# Altium schematic sheet TOP.SchDoc: =DocumentName
size A4; Organization: Queen's Formula SAE; Address1: 130 Stuart St, Kingston; Address2: Ontario; Address3: Canada; Address4: K7L 2V9; DocumentNumber: 1; Revision: 0; SheetNumber: 1; SheetTotal: 1
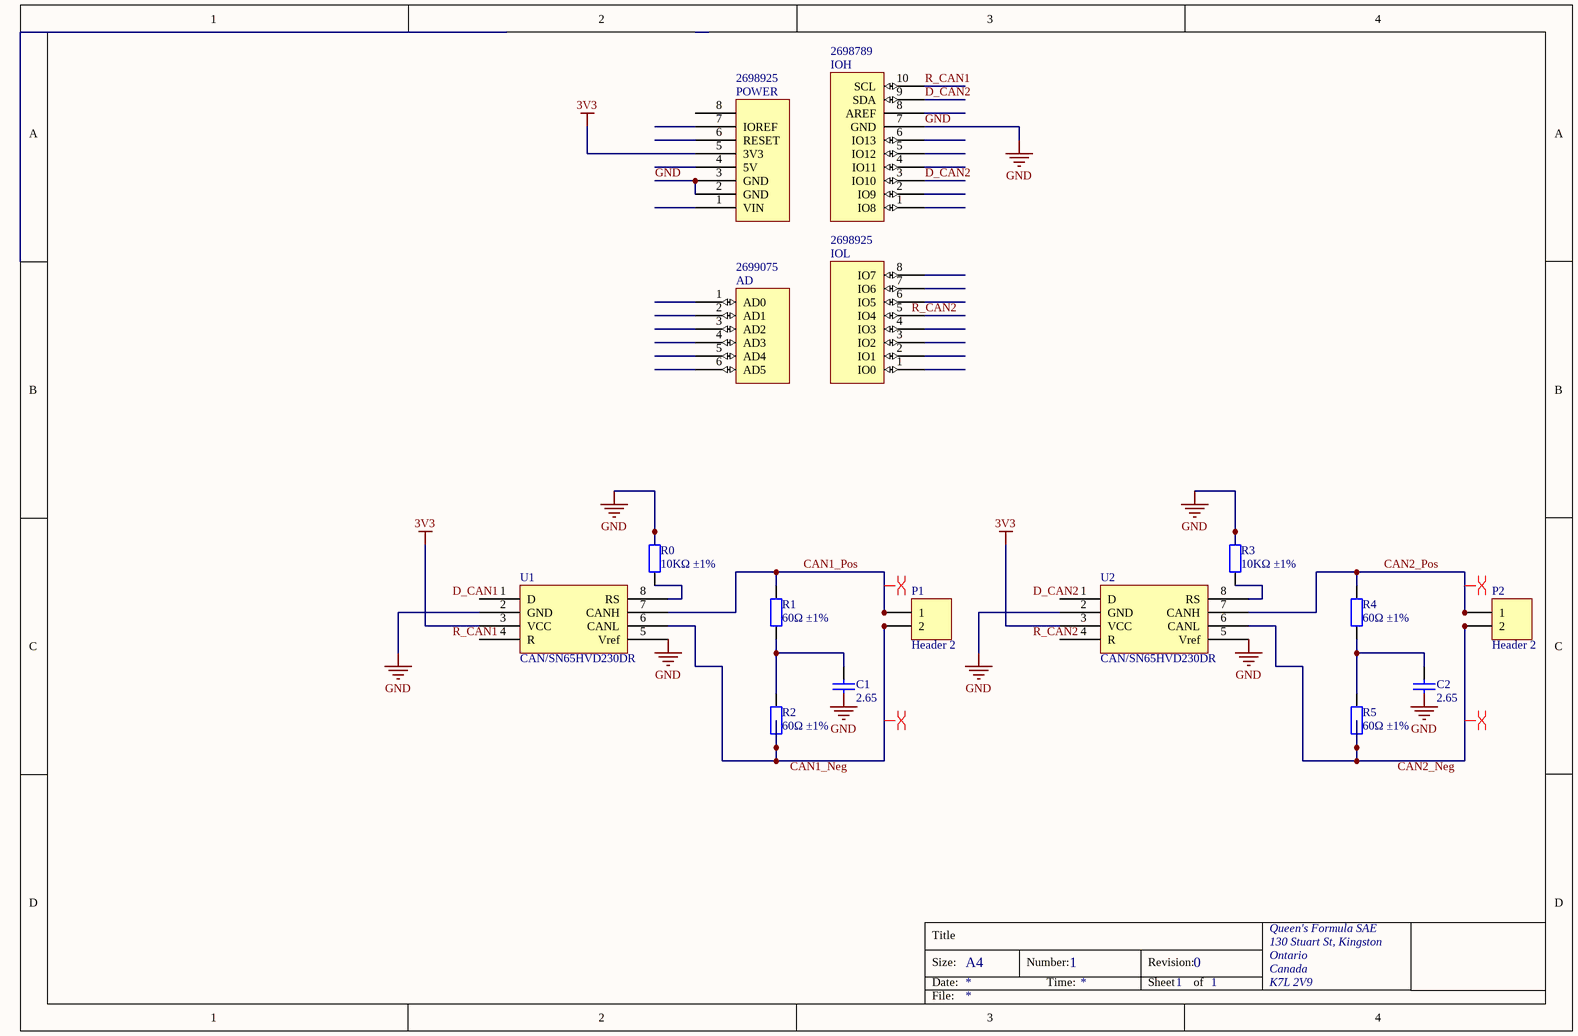
[diagram p0: TOP.SchDoc]

## Parts
AD  Supplier Part Number 4: 2699075  [Header 6x1 8.5mm]  (hidden comment: AD)
C1  2.65  [0402_C]
C2  2.65  [0402_C]
IOH  Supplier Part Number 3: 2698789  [Header 10x1 8.5mm]  (hidden comment: IOH)
IOL  Supplier Part Number 4: 2698925  [Header 8x1 8.5mm]  (hidden comment: IOL)
P1  Header 2  [HDR1X2]
P2  Header 2  [HDR1X2]
POWER  Supplier Part Number 4: 2698925  [Header 8x1 8.5mm]  (hidden comment: POWER_UNO)
R0  10KΩ ±1%  [0402_R]
R1  60Ω ±1%  [0402_R]
R2  60Ω ±1%  [0402_R]
R3  10KΩ ±1%  [0402_R]
R4  60Ω ±1%  [0402_R]
R5  60Ω ±1%  [0402_R]
U1  CAN/SN65HVD230DR  [SOIC-8_150mil]
U2  CAN/SN65HVD230DR  [SOIC-8_150mil]

## Nets
3V3: POWER.5(3V3) U1.3(VCC) U2.3(VCC)
GND: IOH.7(GND) POWER.2(GND) POWER.3(GND) R0.2 R3.2 U1.2(GND) U1.5(Vref) U2.2(GND) U2.5(Vref)
CAN1_Pos: P1.1 R1.2 U1.7(CANH)
CAN2_Pos: P2.1 R4.2 U2.7(CANH)
D_CAN2: IOH.3(IO10) IOH.9(SDA)
R_CAN1: IOH.10(SCL)
NetC1_1: C1.1 R1.1 R2.2
NetC2_1: C2.1 R4.1 R5.2
NetP1_2: P1.2 R2.1 U1.6(CANL)
NetP2_2: P2.2 R5.1 U2.6(CANL)
NetR0_1: R0.1 U1.8(RS)
NetR3_1: R3.1 U2.8(RS)

Not connected (* = marked no-connect by the designer): AD 1(AD0) 2(AD1) 3(AD2) 4(AD3) 5(AD4) 6(AD5); C1 2; C2 2; IOH 1(IO8) 2(IO9) 4(IO11) 5(IO12) 6(IO13) 8(AREF); IOL 1(IO0) 2(IO1) 3(IO2) 4(IO3) 5(IO4) 6(IO5) 7(IO6) 8(IO7); POWER 1(VIN) 4(5V) 6(RESET) 7(IOREF) 8; U1 1(D) 4(R); U2 1(D) 4(R)

## Layout directives
differential pair: CAN1_Pos, CAN2_Pos, NetP1_2, NetP2_2

## Notes on the sheet
- Labels drawn without touching a wire or pin: CAN1_Neg, CAN2_Neg, D_CAN1, D_CAN2, GND, R_CAN1, R_CAN2
- Title
- Size:
- Date:
- A4
- Number:
- Time:
- Revision:
- Sheet
- of
- File:

## Library data of the parts
C1 C2 = 0402 1nF (102) 10% 50V: Chip capacitor; Manufacturer: Guangdong Fenghua Advanced Tech; PartNumber: 0402B102K500NT; Capacitance: 1nF; Tolerance: 10%; Voltage: 50V; ComponentLink1Description: Supplier link; ComponentLink1URL: http://www.szlcsc.com/product/details_1875.html; Package: 0402; Supplier: LC; SuppliersPartNumber: C1523
P1 P2 = Header 2: Header, 2-Pin; LatestRevisionDate: 17-Jul-2002; LatestRevisionNote: Re-released for DXP Platform.; Publisher: Altium Limited
R0 R3 = 0402 10K (1002) 1%: Chip resistor; Manufacturer: Uniroyal Elec; PartNumber: 0402WGF1002TCE; Power: 1/16W; ComponentLink1Description: Supplier link; ComponentLink1URL: http://www.szlcsc.com/product/details_26487.html; Package: 0402; Supplier: LC; SuppliersPartNumber: C25744; Resistance: 10KΩ; Tolerance: 1%
R1 R2 R4 R5 = 0402 10K (1002) 1%: Chip resistor; Manufacturer: Uniroyal Elec; PartNumber: 0402WGF1002TCE; Power: 1/16W; Resistance: 10KΩ; ComponentLink1Description: Supplier link; ComponentLink1URL: http://www.szlcsc.com/product/details_26487.html; Package: 0402; Supplier: LC; SuppliersPartNumber: C25744; Tolerance: 1%
U1 U2 = CAN/SN65HVD230DR_[C12084]: CAN; ComponentLink1Description: 供应商链接; ComponentLink1URL: http://www.szlcsc.com/product/details_12661.html; Package: SOIC-8_150mil; Supplier: LC; SuppliersPartNumber: C12084
AD = AD: Supplier 1: Arrow; Supplier Part Number 1: 2699089; Supplier 2: Digi-Key; Supplier Part Number 2: SAM1198-06-ND; Supplier 3: Arrow; Supplier Part Number 3: 2699088; Supplier 4: Arrow
IOH = IOH: Supplier 1: Arrow; Supplier Part Number 1: 2698803S4475693N1004; Supplier 2: Digi-Key; Supplier Part Number 2: SAM1198-10-ND; Supplier 3: Arrow
IOL = IOL: Supplier 1: Digi-Key; Supplier Part Number 1: SAM1198-08-ND; Supplier 2: Arrow; Supplier Part Number 2: 2698939; Supplier 3: Arrow; Supplier Part Number 3: 2698940; Supplier 4: Arrow
POWER = POWER_UNO: Supplier 1: Digi-Key; Supplier Part Number 1: SAM1198-08-ND; Supplier 2: Arrow; Supplier Part Number 2: 2698939; Supplier 3: Arrow; Supplier Part Number 3: 2698940; Supplier 4: Arrow